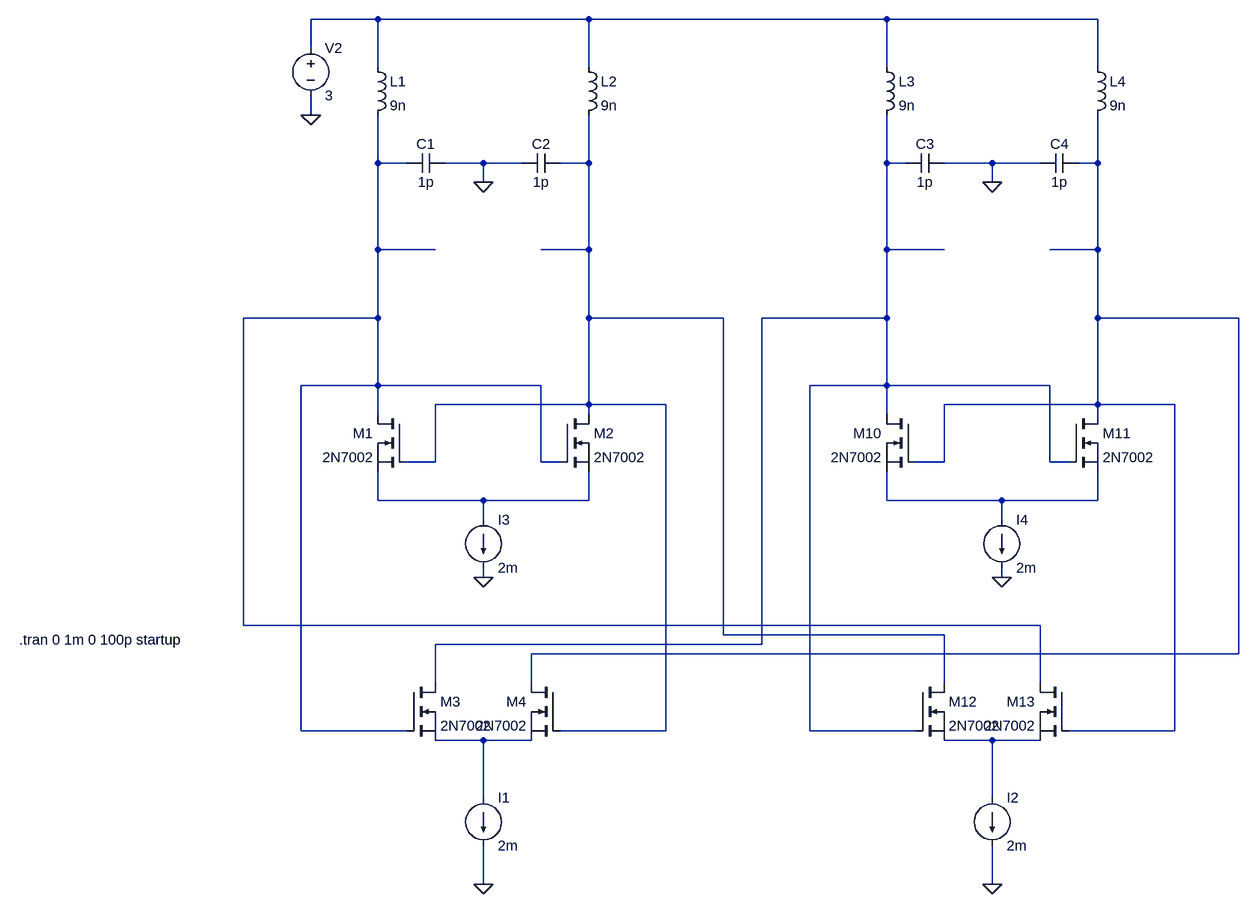
[diagram p0: schematic QPSK_Phase_Shift_2.asc]
QPSK_Phase_Shift_2.asc, the LTspice schematic file:
Version 4
SHEET 1 4200 884
WIRE 1168 -1072 1056 -1072
WIRE 1520 -1072 1168 -1072
WIRE 2016 -1072 1520 -1072
WIRE 2368 -1072 2016 -1072
WIRE 1056 -1024 1056 -1072
WIRE 1168 -992 1168 -1072
WIRE 1520 -992 1520 -1072
WIRE 2016 -992 2016 -1072
WIRE 2368 -992 2368 -1072
WIRE 1056 -912 1056 -944
WIRE 1168 -832 1168 -912
WIRE 1216 -832 1168 -832
WIRE 1344 -832 1280 -832
WIRE 1408 -832 1344 -832
WIRE 1520 -832 1520 -912
WIRE 1520 -832 1472 -832
WIRE 2016 -832 2016 -912
WIRE 2048 -832 2016 -832
WIRE 2192 -832 2112 -832
WIRE 2272 -832 2192 -832
WIRE 2368 -832 2368 -912
WIRE 2368 -832 2336 -832
WIRE 1344 -800 1344 -832
WIRE 2192 -800 2192 -832
WIRE 1168 -688 1168 -832
WIRE 1264 -688 1168 -688
WIRE 1520 -688 1520 -832
WIRE 1520 -688 1440 -688
WIRE 2016 -688 2016 -832
WIRE 2112 -688 2016 -688
WIRE 2368 -688 2368 -832
WIRE 2368 -688 2288 -688
WIRE 1168 -560 1168 -688
WIRE 1168 -560 944 -560
WIRE 1520 -560 1520 -688
WIRE 1744 -560 1520 -560
WIRE 2016 -560 2016 -688
WIRE 2016 -560 1808 -560
WIRE 2368 -560 2368 -688
WIRE 2640 -560 2368 -560
WIRE 1168 -448 1168 -560
WIRE 1168 -448 1040 -448
WIRE 1440 -448 1168 -448
WIRE 2016 -448 2016 -560
WIRE 2016 -448 1888 -448
WIRE 2288 -448 2016 -448
WIRE 1520 -416 1520 -560
WIRE 1520 -416 1264 -416
WIRE 1648 -416 1520 -416
WIRE 2368 -416 2368 -560
WIRE 2368 -416 2112 -416
WIRE 2496 -416 2368 -416
WIRE 1168 -400 1168 -448
WIRE 1520 -400 1520 -416
WIRE 2016 -400 2016 -448
WIRE 2368 -400 2368 -416
WIRE 1264 -320 1264 -416
WIRE 1264 -320 1216 -320
WIRE 1440 -320 1440 -448
WIRE 1472 -320 1440 -320
WIRE 2112 -320 2112 -416
WIRE 2112 -320 2064 -320
WIRE 2288 -320 2288 -448
WIRE 2320 -320 2288 -320
WIRE 1168 -256 1168 -304
WIRE 1344 -256 1168 -256
WIRE 1520 -256 1520 -304
WIRE 1520 -256 1344 -256
WIRE 2016 -256 2016 -304
WIRE 2208 -256 2016 -256
WIRE 2368 -256 2368 -304
WIRE 2368 -256 2208 -256
WIRE 1344 -224 1344 -256
WIRE 2208 -224 2208 -256
WIRE 1344 -128 1344 -144
WIRE 2208 -128 2208 -144
WIRE 944 -48 944 -560
WIRE 2272 -48 944 -48
WIRE 1744 -32 1744 -560
WIRE 2112 -32 1744 -32
WIRE 1808 -16 1808 -560
WIRE 1808 -16 1264 -16
WIRE 2640 0 2640 -560
WIRE 2640 0 1424 0
WIRE 1264 48 1264 -16
WIRE 1424 48 1424 0
WIRE 2112 48 2112 -32
WIRE 2272 48 2272 -48
WIRE 1040 128 1040 -448
WIRE 1216 128 1040 128
WIRE 1648 128 1648 -416
WIRE 1648 128 1472 128
WIRE 1888 128 1888 -448
WIRE 2064 128 1888 128
WIRE 2496 128 2496 -416
WIRE 2496 128 2320 128
WIRE 1344 144 1264 144
WIRE 1424 144 1344 144
WIRE 2192 144 2112 144
WIRE 2272 144 2192 144
WIRE 1344 240 1344 144
WIRE 2192 240 2192 144
WIRE 1344 384 1344 320
WIRE 2192 384 2192 320
FLAG 1056 -912 0
FLAG 1344 384 0
FLAG 2192 384 0
FLAG 1344 -800 0
FLAG 2192 -800 0
FLAG 1344 -128 0
FLAG 2208 -128 0
SYMBOL nmos 1216 -400 M0
SYMATTR InstName M1
SYMATTR Value 2N7002
SYMBOL nmos 1472 -400 R0
SYMATTR InstName M2
SYMATTR Value 2N7002
SYMBOL nmos 1216 48 R0
SYMATTR InstName M3
SYMATTR Value 2N7002
SYMBOL nmos 1472 48 M0
SYMATTR InstName M4
SYMATTR Value 2N7002
SYMBOL nmos 2064 -400 M0
SYMATTR InstName M10
SYMATTR Value 2N7002
SYMBOL nmos 2320 -400 R0
SYMATTR InstName M11
SYMATTR Value 2N7002
SYMBOL nmos 2064 48 R0
SYMATTR InstName M12
SYMATTR Value 2N7002
SYMBOL nmos 2320 48 M0
SYMATTR InstName M13
SYMATTR Value 2N7002
SYMBOL voltage 1056 -1040 R0
WINDOW 123 0 0 Left 0
WINDOW 39 0 0 Left 0
SYMATTR InstName V2
SYMATTR Value 3
SYMBOL current 1344 240 R0
WINDOW 123 0 0 Left 0
WINDOW 39 0 0 Left 0
SYMATTR InstName I1
SYMATTR Value 2m
SYMBOL current 2192 240 R0
WINDOW 123 0 0 Left 0
WINDOW 39 0 0 Left 0
SYMATTR InstName I2
SYMATTR Value 2m
SYMBOL ind 1152 -1008 R0
SYMATTR InstName L1
SYMATTR Value 9n
SYMBOL ind 1504 -1008 R0
SYMATTR InstName L2
SYMATTR Value 9n
SYMBOL ind 2000 -1008 R0
SYMATTR InstName L3
SYMATTR Value 9n
SYMBOL ind 2352 -1008 R0
SYMATTR InstName L4
SYMATTR Value 9n
SYMBOL cap 1280 -848 R90
WINDOW 0 0 32 VBottom 2
WINDOW 3 32 32 VTop 2
SYMATTR InstName C1
SYMATTR Value 1p
SYMBOL cap 1472 -848 R90
WINDOW 0 0 32 VBottom 2
WINDOW 3 32 32 VTop 2
SYMATTR InstName C2
SYMATTR Value 1p
SYMBOL cap 2112 -848 R90
WINDOW 0 0 32 VBottom 2
WINDOW 3 32 32 VTop 2
SYMATTR InstName C3
SYMATTR Value 1p
SYMBOL cap 2336 -848 R90
WINDOW 0 0 32 VBottom 2
WINDOW 3 32 32 VTop 2
SYMATTR InstName C4
SYMATTR Value 1p
SYMBOL current 1344 -224 R0
WINDOW 123 0 0 Left 0
WINDOW 39 0 0 Left 0
SYMATTR InstName I3
SYMATTR Value 2m
SYMBOL current 2208 -224 R0
WINDOW 123 0 0 Left 0
WINDOW 39 0 0 Left 0
SYMATTR InstName I4
SYMATTR Value 2m
TEXT -672 -24 Left 2 !.tran 0 1m 0 100p startup

The netlist it stands for:
* QPSK_Phase_Shift_2.asc
M1 N002 N003 N006 N006 2N7002
M2 N003 N002 N006 N006 2N7002
M3 N004 N002 N008 N008 2N7002
M4 N005 N003 N008 N008 2N7002
M10 N004 N005 N007 N007 2N7002
M11 N005 N004 N007 N007 2N7002
M12 N003 N004 N009 N009 2N7002
M13 N002 N005 N009 N009 2N7002
V2 N001 0 3
I1 N008 0 2m
I2 N009 0 2m
L1 N001 N002 9n
L2 N001 N003 9n
L3 N001 N004 9n
L4 N001 N005 9n
C1 0 N002 1p
C2 N003 0 1p
C3 0 N004 1p
C4 N005 0 1p
I3 N006 0 2m
I4 N007 0 2m
.model NMOS NMOS
.model PMOS PMOS
.lib standard.mos
.tran 0 1m 0 100p startup
.backanno
.end